# EAGLE design ewal (EAGLE 7.1.0)
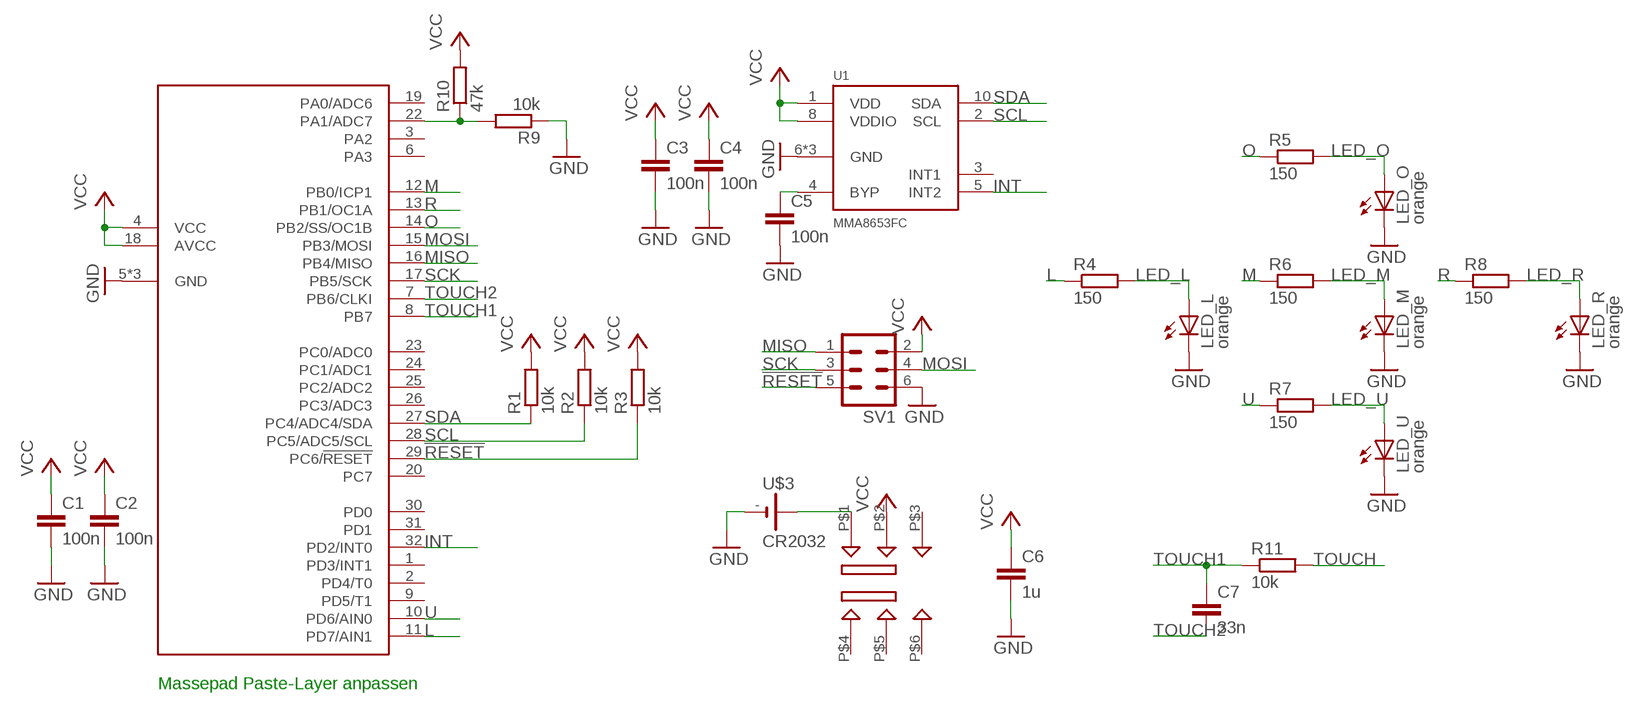
[diagram p0: schematic, sheet 1]

## Parts
C1  100n  C-EUC0603  [C0603]
C2  100n  C-EUC0603  [C0603]
C3  100n  C-EUC0603  [C0603]
C4  100n  C-EUC0603  [C0603]
C5  100n  C-EUC0603  [C0603]
C6  1u  C-EUC0805  [C0805]
C7  33n  C-EUC0603  [C0603]
LED_L  orange  LEDCHIP-LED0603  [CHIP-LED0603]
LED_M  orange  LEDCHIP-LED0603  [CHIP-LED0603]
LED_O  orange  LEDCHIP-LED0603  [CHIP-LED0603]
LED_R  orange  LEDCHIP-LED0603  [CHIP-LED0603]
LED_U  orange  LEDCHIP-LED0603  [CHIP-LED0603]
R1  10k  R-EU_R0603  [R0603]
R2  10k  R-EU_R0603  [R0603]
R3  10k  R-EU_R0603  [R0603]
R4  150  R-EU_R0603  [R0603]
R5  150  R-EU_R0603  [R0603]
R6  150  R-EU_R0603  [R0603]
R7  150  R-EU_R0603  [R0603]
R8  150  R-EU_R0603  [R0603]
R9  10k  R-EU_R0603  [R0603]
R10  47k  R-EU_R0603  [R0603]
R11  10k  R-EU_R0603  [R0603]
SV1  MA03-2  [MA03-2]
U1  MMA8653FC  [2X2_DFN_LONGPADS]
U2  ATTINY48  [MLF32-TH]
U$3  CR2032  [BK-912]
U$4  JS202011SCQN  [JS202011SCQN]

## Nets
!RESET: R3.1 SV1.5 U2.29(PC6/!RESET)
GND: C1.2 C2.2 C3.2 C4.2 C5.2 C6.2 LED_L.C LED_M.C LED_O.C LED_R.C LED_U.C R9.1 SV1.6 U1.6(GND) U1.7(GND) U1.9(GND) U2.5(GND) U2.21(GND) U2.TH(GND) U$3.-
INT: U1.5(INT2) U2.32(PD2/INT0)
L: R4.1 U2.11(PD7/AIN1)
LED_L: LED_L.A R4.2
LED_M: LED_M.A R6.2
LED_O: LED_O.A R5.2
LED_R: LED_R.A R8.2
LED_U: LED_U.A R7.2
M: R6.1 U2.12(PB0/ICP1)
MISO: SV1.1 U2.16(PB4/MISO)
MOSI: SV1.4 U2.15(PB3/MOSI)
N$1: C5.1 U1.4(BYP)
O: R5.1 U2.14(PB2/SS/OC1B)
R: R8.1 U2.13(PB1/OC1A)
SCK: SV1.3 U2.17(PB5/SCK)
SCL: R2.1 U1.2(SCL) U2.28(PC5/ADC5/SCL)
SDA: R1.1 U1.10(SDA) U2.27(PC4/ADC4/SDA)
TOUCH: R11.2
TOUCH1: C7.1 R11.1 U2.8(PB7)
TOUCH2: C7.2 U2.7(PB6/CLKI)
U: R7.1 U2.10(PD6/AIN0)
V_BAT: U$3.+@1(+) U$3.+@2(+) U$4.P$1
V_SENSE: R9.2 R10.1 U2.22(PA1/ADC7)
VCC: C1.1 C2.1 C3.1 C4.1 C6.1 R1.2 R2.2 R3.2 R10.2 SV1.2 U1.1(VDD) U1.8(VDDIO) U2.4(VCC) U2.18(AVCC) U$4.P$2
Unconnected: U1.3(INT1) U2.1(PD3/INT1) U2.2(PD4/T0) U2.3(PA2) U2.6(PA3) U2.9(PD5/T1) U2.19(PA0/ADC6) U2.20(PC7) U2.23(PC0/ADC0) U2.24(PC1/ADC1) U2.25(PC2/ADC2) U2.26(PC3/ADC3) U2.30(PD0) U2.31(PD1) U$4.P$3 U$4.P$4 U$4.P$5 U$4.P$6

## Notes on the sheet
- Massepad Paste-Layer anpassen

## Library data of the parts
C1-C7 = rcl:C-EU: CAPACITOR, European symbol
LED_L LED_M LED_O LED_R LED_U = led:LED: LED OSRAM: - CHIPLED LG R971, LG N971, LY N971, LG Q971, LY Q971, LO R971, LY R971 LH N974, LH R974 LS Q976, LO Q976, LY Q976 LO Q996 - Hyper CHIPLED LW Q18S LB Q993, LB Q99A, LB R99A - SideLED LS A670, LO A670, LY A670, LG A670, LP A670 LB A673, LV A673, LT A673, LW A673 LH A674 LY A675 LS A676, LA A676, LO A676, LY A676, LW A676 LS A679, LY A679, LG A679 - Hyper Micro SIDELED® LS Y876, LA Y876, LO Y876, LY Y876 LT Y87S - SmartLED LW L88C, LW L88S LB L89C, LB L89S, LG L890 LS L89K, LO L89K, LY L89K LS L896, LA L896, LO L896, LY L896 - TOPLED LS T670, LO T670, LY T670, LG T670, LP T670 LSG T670, LSP T670, LSY T670, LOP T670, LYG T670 LG T671, LOG T671, LSG T671 LB T673, LV T673, LT T673, LW T673 LH T674 LS T676, LA T676, LO T676, LY T676, LB T676, LH T676, LSB T676, LW T676 LB T67C, LV T67C, LT T67C, LS T67K, LO T67K, LY T67K, LW E67C LS E67B, LA E67B, LO E67B, LY E67B, LB E67C, LV E67C, LT E67C LW T67C LS T679, LY T679, LG T679 LS T770, LO T770, LY T770, LG T770, LP T770 LB T773, LV T773, LT T773, LW T773 LH T774 LS E675, LA E675, LY E675, LS T675 LS T776, LA T776, LO T776, LY T776, LB T776 LHGB T686 LT T68C, LB T68C - Hyper Mini TOPLED® LB M676 - Mini TOPLED Santana® LG M470 LS M47K, LO M47K, LY M47K Source: http://www.osram.convergy.de LUXEON: - LUMILED® LXK2-PW12-R00, LXK2-PW12-S00, LXK2-PW14-U00, LXK2-PW14-V00 LXK2-PM12-R00, LXK2-PM12-S00, LXK2-PM14-U00 LXK2-PE12-Q00, LXK2-PE12-R00, LXK2-PE12-S00, LXK2-PE14-T00, LXK2-PE14-U00 LXK2-PB12-K00, LXK2-PB12-L00, LXK2-PB12-M00, LXK2-PB14-N00, LXK2-PB14-P00, LXK2-PB14-Q00 LXK2-PR12-L00, LXK2-PR12-M00, LXK2-PR14-Q00, LXK2-PR14-R00 LXK2-PD12-Q00, LXK2-PD12-R00, LXK2-PD12-S00 LXK2-PH12-R00, LXK2-PH12-S00 LXK2-PL12-P00, LXK2-PL12-Q00, LXK2-PL12-R00 Source: www.luxeon.com KINGBRIGHT: KA-3528ASYC Source: www.kingbright.com
R1-R11 = rcl:R-EU_: RESISTOR, European symbol
SV1 = con-lstb:MA03-2: PIN HEADER; OC_FARNELL: unknown; OC_NEWARK: unknown
U1 = gpn14_smd:MMA8653FC
U2 = gpn14_smd:ATTINY48
U$3 = gpn14_smd:CR2032
U$4 = gpn14_smd:JS202011SCQN

## Board
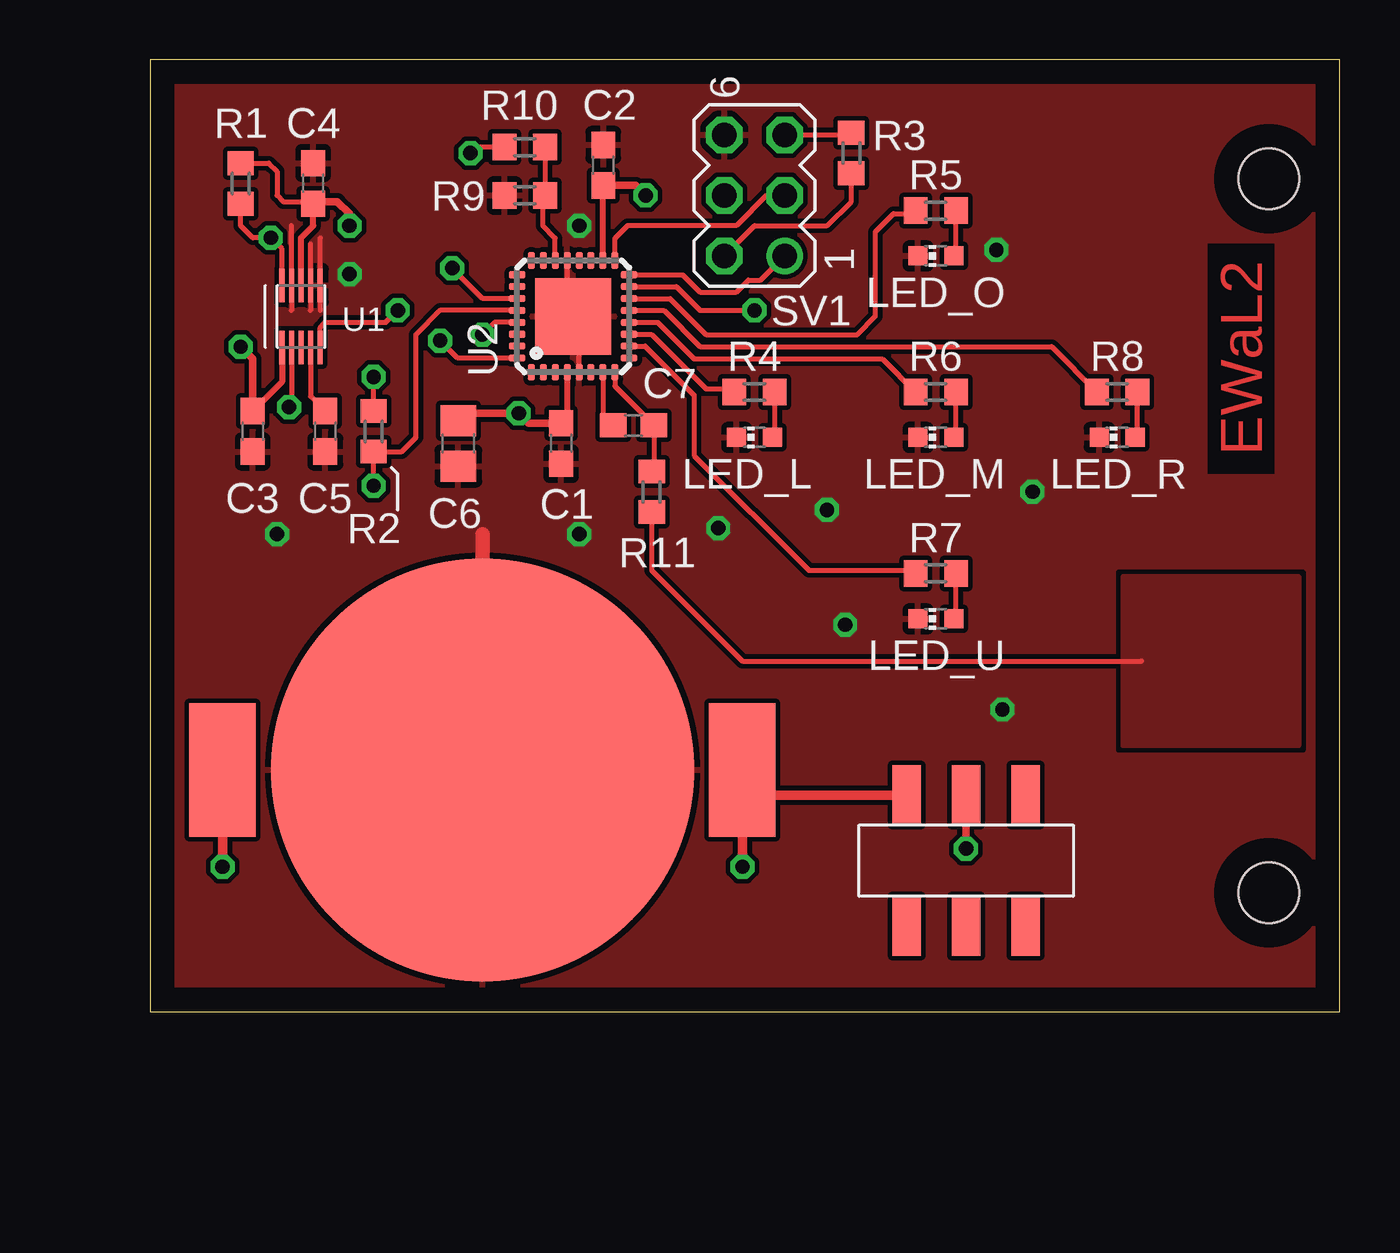
[diagram p1: board, top side]
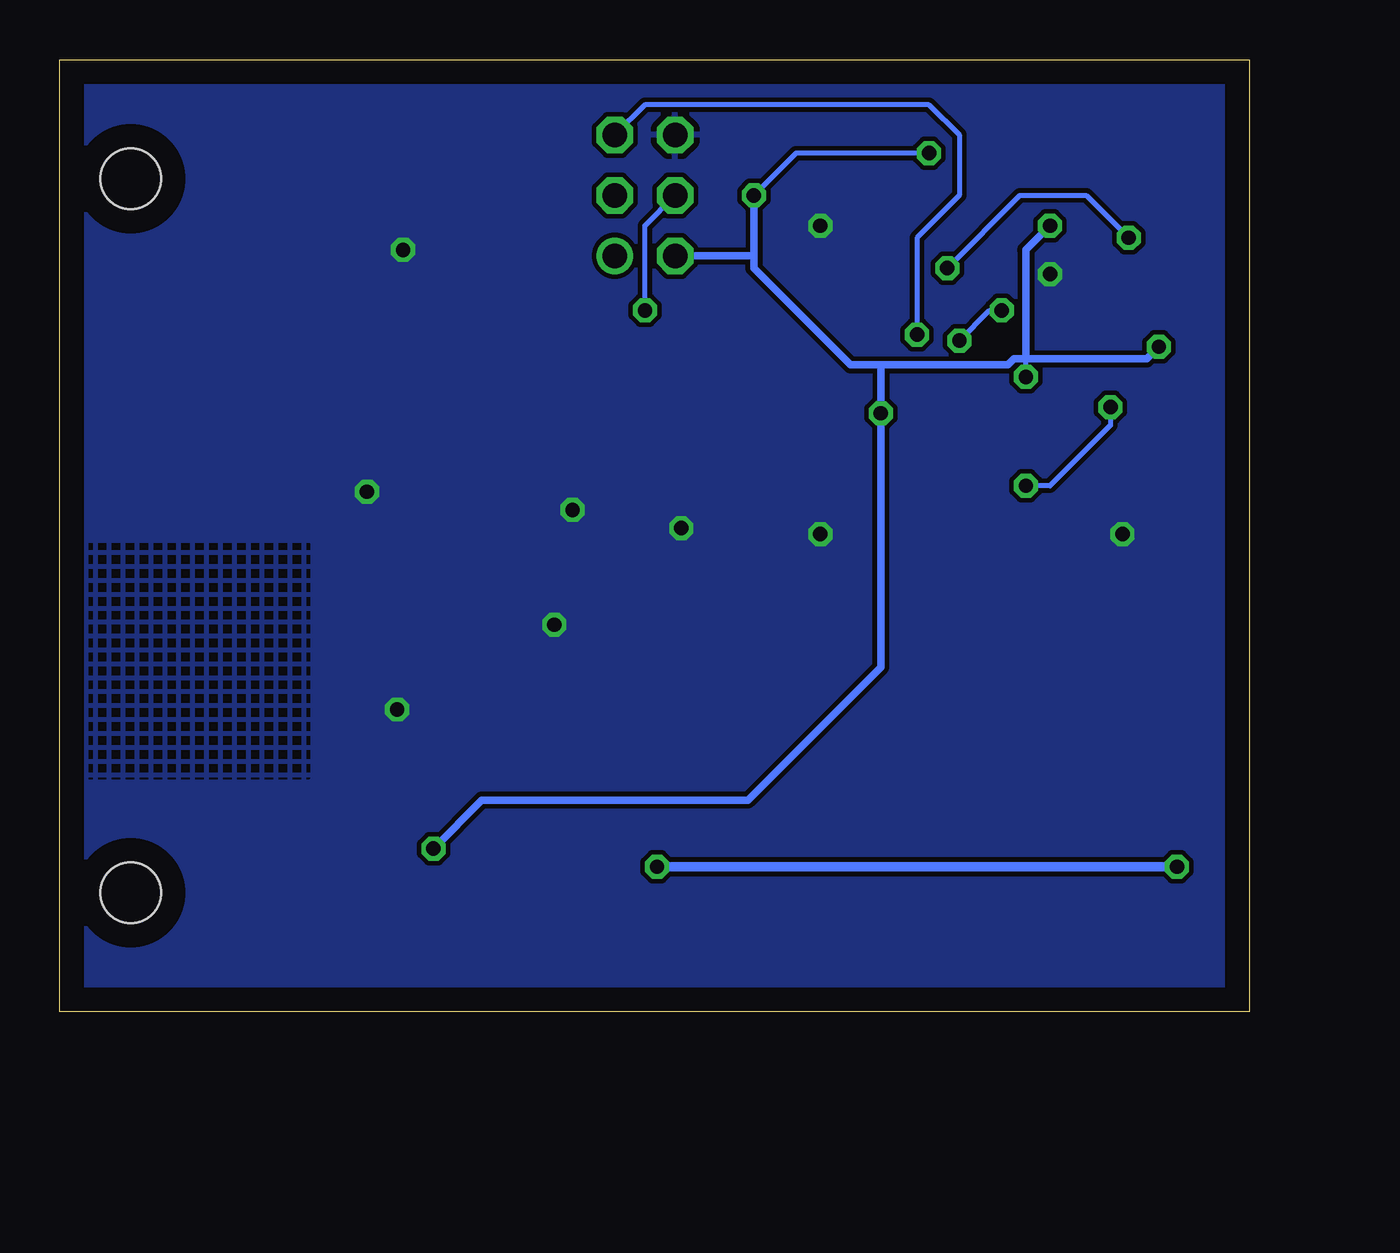
[diagram p2: board, bottom side, seen from below]

Size 50 x 40 mm. Coordinates in mm from the lower left corner, seen from the top.
Outline: 0,0 50,0 50,40 0,40 0,0
Copper layers (1*16): Top 0.035mm / dielectric 1.5mm / Bottom 0.035mm
Design rules "default *": minimum track width 10mil, minimum drill 24mil, track to track 8mil, track to pad 8mil, pad to pad 8mil, via to via 8mil, smd to smd 8mil, copper to edge 40mil, drill to drill 8mil, minimum pad ring 10mil, minimum via ring 8mil, stop-mask expansion 4mil, vias tented up to drill 0mil, thermal gap 10mil
Holes 2.55 mm at 47,35 47,5
tRestrict: area 44.5,22.6 to 47.2,32.3

### Footprints (pad centres in the part's own frame; a part is rotated, then mirrored left to right if it is on the bottom)
C0603 = smd 1.1 x 1: 1 -0.85,0; 2 0.85,0
C0805 = smd 1.3 x 1.5: 1 -0.95,0; 2 0.95,0
CHIP-LED0603 = smd 0.8 x 0.8: A 0,-0.75; C 0,0.75
R0603 = smd 1 x 1.1: 1 -0.85,0; 2 0.85,0
MA03-2 = drill 1.016: 1 -2.54,-1.27 | drill 1.016 octagon: 2 -2.54,1.27; 3 0,-1.27; 4 0,1.27; 5 2.54,-1.27; 6 2.54,1.27
2X2_DFN_LONGPADS = smd 1.4 x 0.225: 1 -1.3,0.8; 2 -1.3,0.4; 3 -1.3,0; 4 -1.3,-0.4; 5 -1.3,-0.8; 6 1.3,-0.8; 7 1.3,-0.4; 8 1.3,0; 9 1.3,0.4; 10 1.3,0.8
MLF32-TH = smd 0.7 x 0.3: 1 -2.35,1.75; 2 -2.35,1.25; 3 -2.35,0.75; 4 -2.35,0.25; 5 -2.35,-0.25; 6 -2.35,-0.75; 7 -2.35,-1.25; 8 -2.35,-1.75; 17 2.35,-1.75; 18 2.35,-1.25; 19 2.35,-0.75; 20 2.35,-0.25; 21 2.35,0.25; 22 2.35,0.75; 23 2.35,1.25; 24 2.35,1.75 | smd 0.3 x 0.7: 9 -1.75,-2.35; 10 -1.25,-2.35; 11 -0.75,-2.35; 12 -0.25,-2.35; 13 0.25,-2.35; 14 0.75,-2.35; 15 1.25,-2.35; 16 1.75,-2.35; 25 1.75,2.35; 26 1.25,2.35; 27 0.75,2.35; 28 0.25,2.35; 29 -0.25,2.35; 30 -0.75,2.35; 31 -1.25,2.35; 32 -1.75,2.35 | smd 3.2 x 3.2: TH 0,0
BK-912 = smd 2.794 x 5.588: +@1 -10.922,0; +@2 10.922,0 | smd 17.78 x 17.78: - 0,0
JS202011SCQN = smd 1.2 x 2.5: P$1 -2.5,2.75; P$2 0,2.75; P$3 2.5,2.75; P$4 -2.5,-2.75; P$5 0,-2.75; P$6 2.5,-2.75

### Placement (x,y rotation side)
C1  17.27,23.88 270 top
C2  19.05,35.56 90 top
C3  4.32,24.38 270 top
C4  6.86,34.8 90 top
C5  7.37,24.38 270 top
C6  12.95,23.88 270 top
C7  20.32,24.64 180 top
LED_L  25.4,24.13 90 top
LED_M  33.02,24.13 90 top
LED_O  33.02,31.75 90 top
LED_R  40.64,24.13 90 top
LED_U  33.02,16.51 90 top
R1  3.81,34.8 90 top
R2  9.4,24.38 90 top
R3  29.46,36.07 270 top
R4  25.4,26.04 0 top
R5  33.02,33.66 0 top
R6  33.02,26.04 0 top
R7  33.02,18.41 0 top
R8  40.64,26.04 0 top
R9  15.75,34.29 0 top
R10  15.75,36.32 180 top
R11  21.08,21.84 270 top
SV1  25.4,34.29 90 top
U1  6.35,29.21 90 top
U2  17.78,29.21 90 top
U$3  13.97,10.16 0 top
U$4  34.29,6.35 0 top

### Tracks (layer width: path | path; a pad name or v marks a point on that pad's centre or on a via)
!RESET  (via drill 0.6)
  Top 0.203: SV1.5 29.38,36.83 R3.1 | U2.29 14.48,28.96 v13.97,28.45
  Bottom 0.203: SV1.5 25.4,38.1 13.46,38.1 12.19,36.83 12.19,34.29 13.97,32.51 v13.97,28.45
GND  (via drill 0.6)
  Top 0.203: U2.5 18.03,29.21 U2.TH 17.53,29.21 U2.21 | 5.95,29.46 U1.9 5.95,33.02 | 6.75,29.46 U1.7 6.75,32.26 | 7.15,32.51 U1.6 7.15,29.46
  Top 0.61: 13.97,18.29 13.97,20.07
  other vias: 8.38,30.99 28.45,21.08 37.08,21.84 18.03,33.02 18.03,20.07 5.33,20.07 35.56,32 29.21,16.26 35.81,12.7 23.88,20.32
  pour Top (rank 2): -1.27,-1.27 50.8,-1.27 50.8,40.64 -1.27,40.64
  pour Bottom (rank 3): -1.27,40.64 50.8,40.64 50.8,19.81 39.37,19.81 39.37,9.65 50.8,9.65 50.8,-1.27 -1.27,-1.27
  pour Bottom (rank 3, hatched): 39.37,19.81 50.04,19.81 50.04,9.65 39.37,9.65
INT  (via drill 0.6)
  Top 0.203: U2.32 12.93,27.46 v12.19,28.19 | v10.41,29.46 9.91,28.96 7.37,28.96 7.15,28.74 U1.5
  Bottom 0.203: v12.19,28.19 10.92,29.46 v10.41,29.46
L
  Top 0.203: U2.11 21.07,28.46 23.37,26.16 24.42,26.16 R4.1
LED_L
  Top 0.203: LED_L.A 26.25,24.13 R4.2
LED_M
  Top 0.203: LED_M.A 33.87,24.13 R6.2
LED_O
  Top 0.203: LED_O.A 33.87,31.75 R5.2
LED_R
  Top 0.203: LED_R.A 41.49,24.13 R8.2
LED_U
  Top 0.203: LED_U.A 33.87,16.51 R7.2
M
  Top 0.203: U2.12 21.33,28.96 22.86,27.43 30.77,27.43 R6.1
MISO
  Top 0.203: U2.16 22.38,30.96 23.11,30.23 24.64,30.23 25.15,30.73 25.65,30.73 SV1.1
MOSI  (via drill 0.6)
  Top 0.203: U2.15 22.12,30.46 23.11,29.46 v25.4,29.46
  Bottom 0.203: v25.4,29.46 25.4,33.02 SV1.4
N$1
  Top 0.203: U1.4 6.75,25.85 C5.1
O
  Top 0.203: U2.14 21.86,29.96 23.37,28.45 29.72,28.45 30.48,29.21 30.48,32.77 31.24,33.53 32.04,33.53 R5.1
R
  Top 0.203: U2.13 21.59,29.46 23.11,27.94 37.88,27.94 R8.1
SCK
  Top 0.203: SV1.3 25.91,34.29 24.64,33.02 20.07,33.02 19.53,32.48 U2.17
SCL  (via drill 0.6)
  Top 0.203: U1.2 5.95,25.51 v5.84,25.4 | v9.4,22.1 R2.1 10.58,23.53 11.18,24.13 11.18,28.45 12.19,29.46 U2.28
  Bottom 0.203: v5.84,25.4 5.84,24.64 8.38,22.1 v9.4,22.1
SDA  (via drill 0.6)
  Top 0.203: U1.10 5.55,32.04 v5.08,32.51 4.32,32.51 3.81,33.02 R1.1 | U2.27 13.98,29.96 v12.7,31.24
  Bottom 0.203: v12.7,31.24 9.65,34.29 6.86,34.29 v5.08,32.51
TOUCH
  Top 0.203: R11.2 21.08,18.54 24.89,14.73 41.66,14.73
  pour Top (isolate 1.27): 40.89,18.29 48.26,18.29 48.26,11.18 40.89,11.18
TOUCH1
  Top 0.203: U2.8 19.53,26.28 C7.1 21.17,22.78 R11.1
TOUCH2
  Top 0.203: U2.7 19.03,25.08 C7.2
U
  Top 0.203: U2.10 20.81,27.96 22.86,25.91 22.86,23.37 27.69,18.54 32.04,18.54 R7.1
V_BAT  (via drill 0.6)
  Top 0.406: U$4.P$1 25.95,9.1 U$3.+@2 v24.89,6.1 | U$3.+@1 v3.05,6.1
  Bottom 0.406: v3.05,6.1 v24.89,6.1
V_SENSE
  Top 0.203: U2.22 17.03,32.5 16.51,33.02 16.51,34.2 R9.2 R10.1
VCC  (via drill 0.6)
  Top 0.203: SV1.2 25.4,33.02 28.45,33.02 29.46,34.04 R3.2 | R10.2 13.72,36.32 v13.46,36.07 | R1.2 4.99,35.65 5.33,35.31 5.33,34.29 5.59,34.04 6.77,34.04 C4.1 | R2.2 v9.4,26.67
  Top 0.254: U2.4 17.53,24.98 C1.1 | U2.18 19.03,34.69 C2.1 | U1.8 6.35,32.51 6.86,33.02 C4.1 | U1.1 5.55,26.47 C3.1
  Top 0.305: C2.1 20.41,34.71 v20.83,34.29 | C1.1 15.91,24.73 v15.49,25.15 13.27,25.15 C6.1 | v8.38,33.02 8.38,33.53 7.87,34.04 6.95,34.04 C4.1 | v3.81,27.94 4.32,27.43 C3.1 | v34.29,6.86 U$4.P$2
  Bottom 0.203: v13.46,36.07 19.05,36.07 v20.83,34.29 | v9.4,26.67 9.4,27.43
  Bottom 0.305: v20.83,34.29 20.83,31.75 | SV1.2 20.83,31.75 | 20.83,31.75 20.83,31.24 16.76,27.18 15.49,27.18 | 15.49,27.18 10.16,27.18 9.91,27.43 9.4,27.43 | 15.49,27.18 v15.49,25.15 15.49,14.48 21.08,8.89 32.26,8.89 v34.29,6.86 | 9.4,27.43 4.32,27.43 v3.81,27.94 | v8.38,33.02 9.4,32 9.4,27.43

### Text on the board
Top: EWaL2